# EAGLE schematic Brooder_sch_v1.1 (EAGLE 9.0.1)
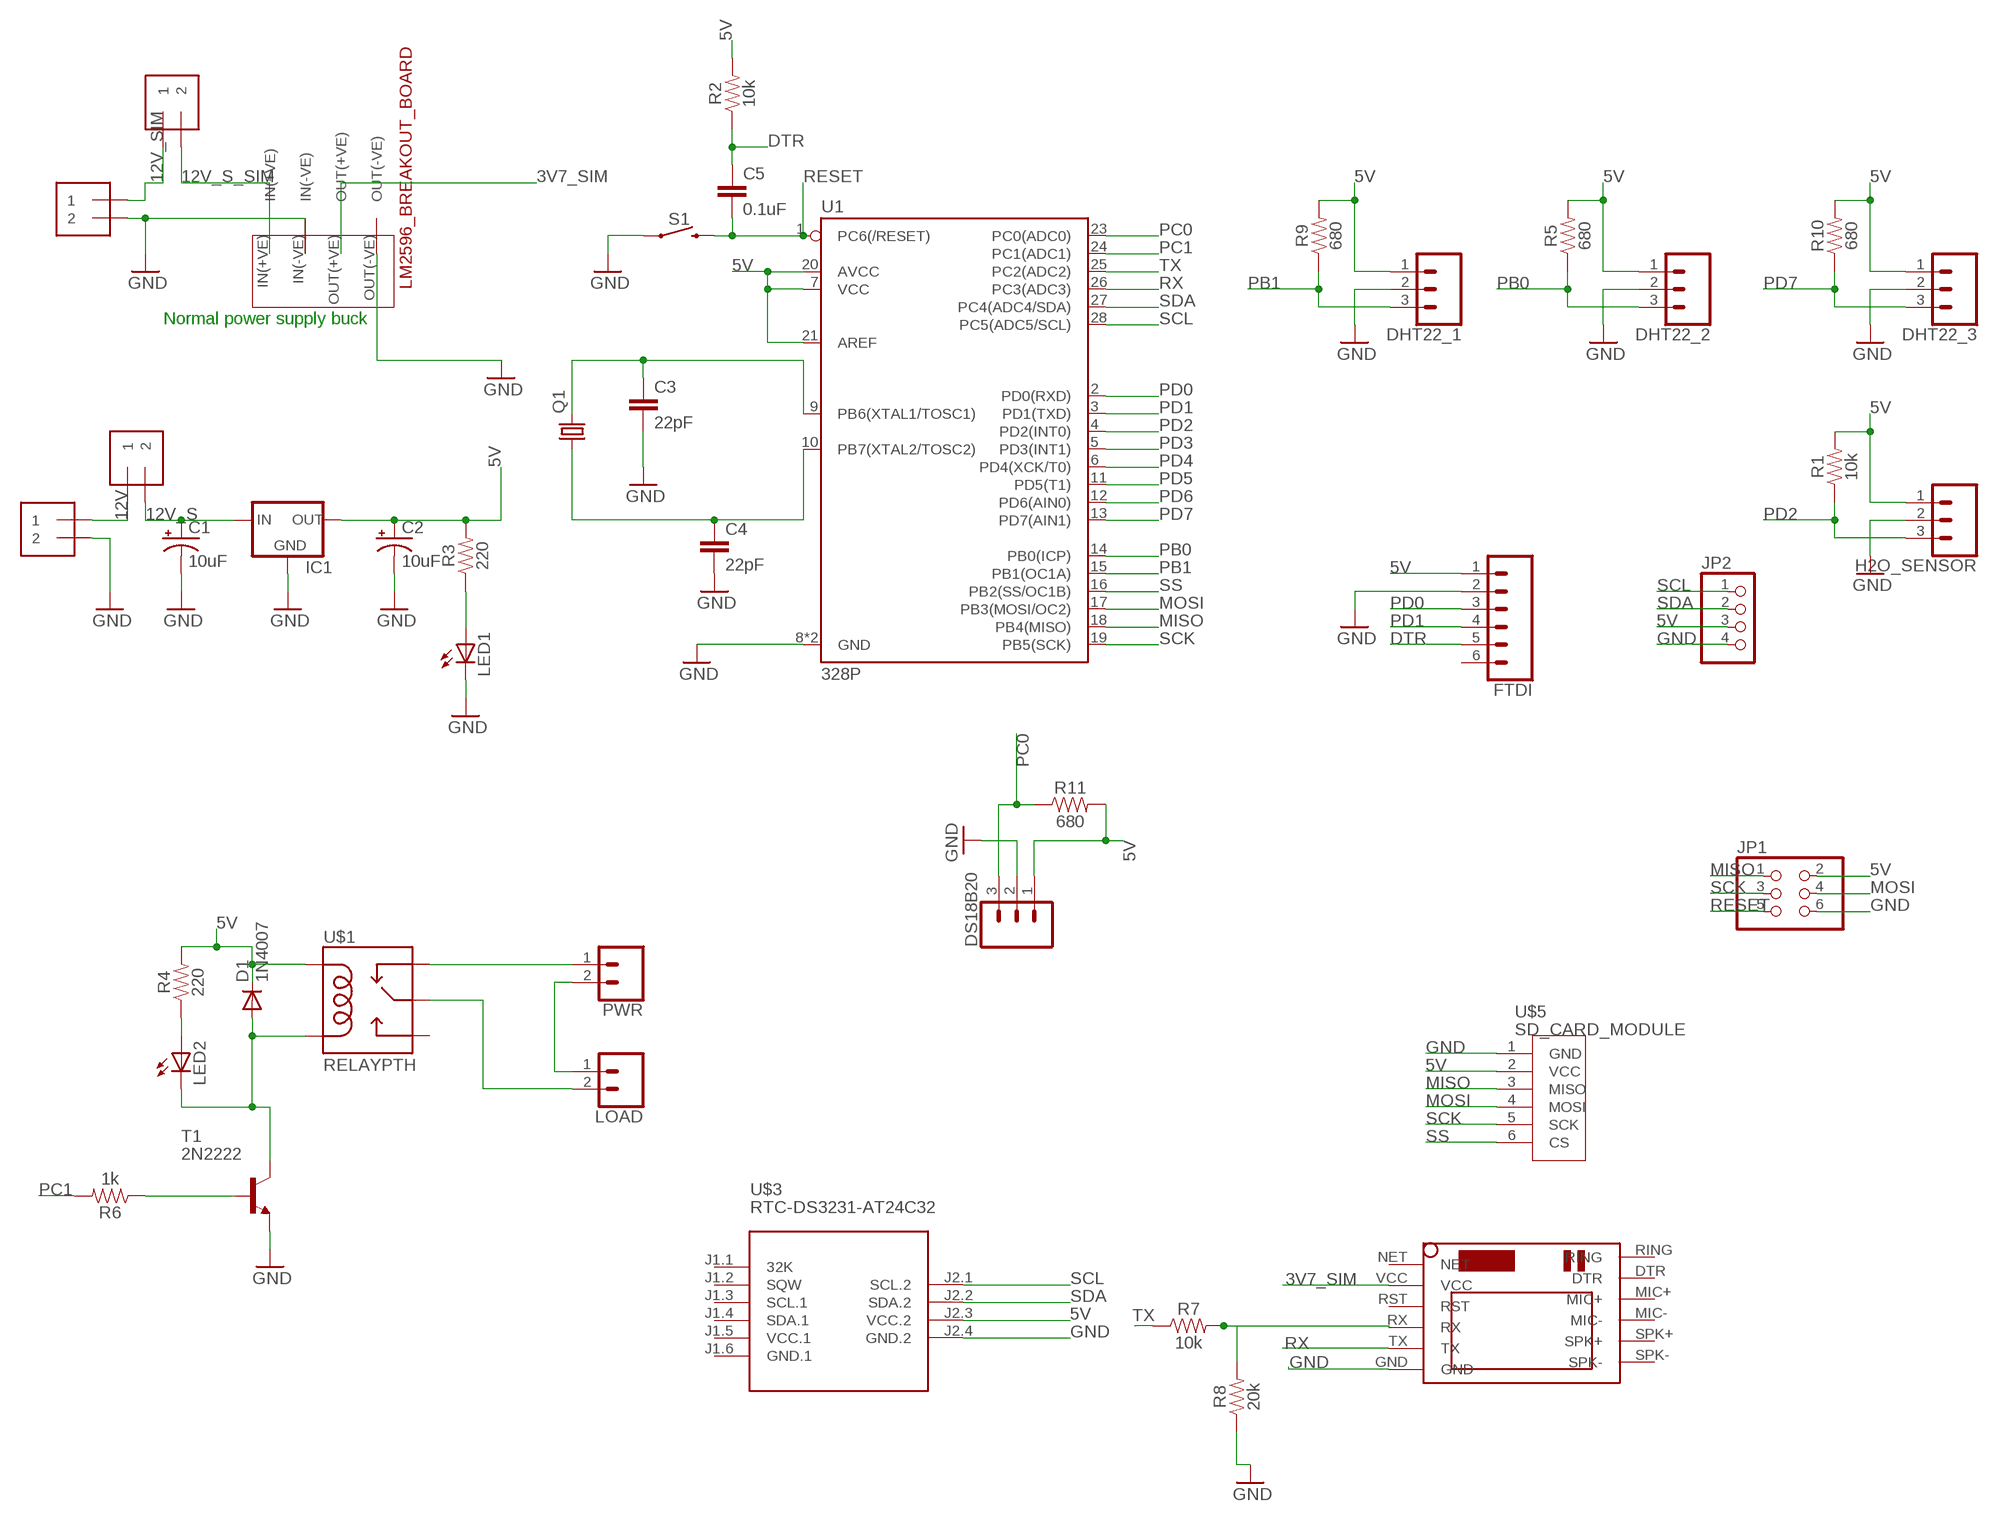
[diagram p0: schematic, sheet 1]

## Parts
12V_GSM  1X2-3.5MM  [1X2-3.5MM]
12V_SYS  1X2-3.5MM  [1X2-3.5MM]
C1  10uF  10UF-POLAR-RADIAL-2.5MM-25V-20%  [CPOL-RADIAL-2.5MM-5MM]
C2  10uF  10UF-POLAR-RADIAL-2.5MM-25V-20%  [CPOL-RADIAL-2.5MM-5MM]
C3  22pF  22PF-PTH-2.54MM-200V-5%  [CAP-PTH-2.54]
C4  22pF  22PF-PTH-2.54MM-200V-5%  [CAP-PTH-2.54]
C5  0.1uF  22PF-PTH-2.54MM-200V-5%  [CAP-PTH-2.54]
D1  1N4007  1N4004  [DO41-10]
DHT22_1  455-1750-1-ND  CONN_03  [1X03]
DHT22_2  455-1750-1-ND  CONN_03  [1X03]
DHT22_3  455-1750-1-ND  CONN_03  [1X03]
DS18B20  455-1750-1-ND  CONN_03  [1X03]
FTDI  CONN_06NO_SILK_FEMALE_PTH  [1X06_NO_SILK]
H2O_SENSOR  455-1750-1-ND  CONN_03  [1X03]
IC1  78XXS  [78XXS]
J2  1X2-3.5MM  [1X2-3.5MM]
J4  1X2-3.5MM  [1X2-3.5MM]
JP1  PINHD-2X3  [2X03]
JP2  PINHD-1X4  [1X04]
LED1  LED5MM  [LED5MM]
LED2  LED5MM  [LED5MM]
LOAD  CONN_025MM  [SCREWTERMINAL-5MM-2]
PWR  CONN_025MM  [SCREWTERMINAL-5MM-2]
Q1  CRYSTALHC49S  [HC49/S]
R1  10k  10MOHM-HORIZ-1/4W-5%  [AXIAL-0.3]
R2  10k  10MOHM-HORIZ-1/4W-5%  [AXIAL-0.3]
R3  220  10MOHM-HORIZ-1/4W-5%  [AXIAL-0.3]
R4  220  10MOHM-HORIZ-1/4W-5%  [AXIAL-0.3]
R5  680  10MOHM-HORIZ-1/4W-5%  [AXIAL-0.3]
R6  1k  10MOHM-HORIZ-1/4W-5%  [AXIAL-0.3]
R7  10k  10MOHM-HORIZ-1/4W-5%  [AXIAL-0.3]
R8  20k  10MOHM-HORIZ-1/4W-5%  [AXIAL-0.3]
R9  680  10MOHM-HORIZ-1/4W-5%  [AXIAL-0.3]
R10  680  10MOHM-HORIZ-1/4W-5%  [AXIAL-0.3]
R11  680  10MOHM-HORIZ-1/4W-5%  [AXIAL-0.3]
S1  SWITCH  MOMENTARY-SWITCH-SPST-PTH-6.0MM  [TACTILE_SWITCH_PTH_6.0MM]
T1  2N2222  [TO92-EBC-OVAL]
U1  328P  ATMEGA328P_PDIP  [DIP28]
U$1  RELAYPTH  [SRD-05VDC-SL-C]
U$2  LM2596_BREAKOUT_BOARDTHROUGH_HOLE  [LM2596_BREAKOUTBOARD]
U$3  RTC-DS3231-AT24C32  [RTC-DS3231-AT24C32]
U$5  SD_CARD_MODULE  [SD_CARD_MODULE]
U$6  SIM800LMODULE  [SIM800LMODULE]

## Nets
3V7_SIM: U$2.OUT(+VE) U$6.VCC
5V: C2.1(+) D1.C DHT22_1.1 DHT22_2.1 DHT22_3.1 DS18B20.1 FTDI.1 H2O_SENSOR.1 IC1.OUT JP1.2 JP2.3 R1.P$2 R2.P$2 R3.P$2 R4.P$2 R5.P$2 R9.P$2 R10.P$2 R11.P$2 U1.7(VCC) U1.20(AVCC) U1.21(AREF) U$1.COIL1 U$3.J2.3(VCC.2) U$5.2(VCC)
12V: 12V_SYS.1 J4.1
12V_S: C1.1(+) IC1.IN J4.2
12V_S_SIM: J2.2 U$2.IN(+VE)
12V_SIM: 12V_GSM.1 J2.1
DTR: C5.1 FTDI.5 R2.P$1
GND: 12V_GSM.2 12V_SYS.2 C1.2(-) C2.2(-) C3.2 C4.2 DHT22_1.2 DHT22_2.2 DHT22_3.2 DS18B20.2 FTDI.2 H2O_SENSOR.2 IC1.GND JP1.6 JP2.4 LED1.K(C) R8.P$1 S1.1 T1.E U1.8(GND) U1.22(GND) U$2.IN(-VE) U$2.OUT(-VE) U$3.J2.4(GND.2) U$5.1(GND) U$6.GND
MISO: JP1.1 U1.18(PB4(MISO)) U$5.3(MISO)
MOSI: JP1.4 U1.17(PB3(MOSI/OC2)) U$5.4(MOSI)
N$1: LOAD.2 U$1.SWCOMMON
N$2: LED1.A R3.P$1
N$3: LOAD.1 PWR.2
N$4: R7.P$2 R8.P$2 U$6.RX
N$5: C4.1 Q1.1 U1.10(PB7(XTAL2/TOSC2))
N$6: D1.A LED2.K(C) T1.C U$1.COIL0
N$7: LED2.A R4.P$1
N$8: C3.1 Q1.2 U1.9(PB6(XTAL1/TOSC1))
N$10: R6.P$1 T1.B
N$13: PWR.1 U$1.SWCLOSED(SWCLOSE)
PB0: DHT22_2.3 R5.P$1 U1.14(PB0(ICP))
PB1: DHT22_1.3 R9.P$1 U1.15(PB1(OC1A))
PC0: DS18B20.3 R11.P$1 U1.23(PC0(ADC0))
PC1: R6.P$2 U1.24(PC1(ADC1))
PD0: FTDI.3 U1.2(PD0(RXD))
PD1: FTDI.4 U1.3(PD1(TXD))
PD2: H2O_SENSOR.3 R1.P$1 U1.4(PD2(INT0))
PD3: U1.5(PD3(INT1))
PD4: U1.6(PD4(XCK/T0))
PD5: U1.11(PD5(T1))
PD6: U1.12(PD6(AIN0))
PD7: DHT22_3.3 R10.P$1 U1.13(PD7(AIN1))
RESET: C5.2 JP1.5 S1.3 U1.1(PC6(/RESET))
RX: U1.26(PC3(ADC3)) U$6.TX
SCK: JP1.3 U1.19(PB5(SCK)) U$5.5(SCK)
SCL: JP2.1 U1.28(PC5(ADC5/SCL)) U$3.J2.1(SCL.2)
SDA: JP2.2 U1.27(PC4(ADC4/SDA)) U$3.J2.2(SDA.2)
SS: U1.16(PB2(SS/OC1B)) U$5.6(CS)
TX: R7.P$1 U1.25(PC2(ADC2))
Unconnected: FTDI.6 U$1.SWOPEN U$3.J1.1(32K) U$3.J1.2(SQW) U$3.J1.3(SCL.1) U$3.J1.4(SDA.1) U$6.DTR U$6.MIC+ U$6.MIC- U$6.NET U$6.RING U$6.RST U$6.SPK+ U$6.SPK-

## Notes on the sheet
- Normal power supply buck

## Power pins joined to a net without a drawn wire
GND.1: U$3.J1.6(GND.1)
VCC.1: U$3.J1.5(VCC.1)

## Library data of the parts
12V_GSM 12V_SYS J2 J4 = adafruit:1X2: 3.5mm Terminal block http://www.ladyada.net/library/pcb/eaglelibrary.html
C1 C2 = SparkFun-Capacitors:10UF-POLAR: 10.0µF polarized capacitors A capacitor is a passive two-terminal electrical component used to store electrical energy temporarily in an electric field.; PROD_ID: CAP-08440
C3 C4 = SparkFun-Capacitors:22PF: 22pF ceramic capacitors A capacitor is a passive two-terminal electrical component used to store electrical energy temporarily in an electric field.; PROD_ID: CAP-09128
C5 = SparkFun-Capacitors:22PF: 22pF ceramic capacitors A capacitor is a passive two-terminal electrical component used to store electrical energy temporarily in an electric field.; PROD_ID: CAP-09128; VALUE: 22pF
D1 = adafruit:1N4004: DIODE General purpose 1N400x type rectifier (With bigger pads) http://www.ladyada.net/library/pcb/eaglelibrary.html
DHT22_1-DHT22_3 DS18B20 H2O_SENSOR = SparkFun-Connectors:CONN_03: Multi connection point. Often used as Generic Header-pin footprint for 0.1 inch spaced/style header connections On any of the 0.1 inch spaced packages, you can populate with these: Break Away Headers - Straight <https://www.sparkfun.com/products/116> (PRT-00116) Break Away Male Headers - Right Angle <https://www.sparkfun.com/products/553> (PRT-00553) Female Headers <https://www.sparkfun.com/products/115> (PRT-00115) Break Away Headers - Machine Pin <https://www.sparkfun.com/products/117> (PRT-00117) Break Away Female Headers - Swiss Machine Pin <https://www.sparkfun.com/products/743> (PRT-00743) Stackable Header - 3 Pin (Female, 0.1") <https://www.sparkfun.com/products/13875> (PRT-13875) For SCREWTERMINALS and SPRING TERMINALS visit here: Screw Terimnals on SparkFun.com <https://www.sparkfun.com/search/results?term=Screw+Terminals> (5mm/3.5mm/2.54mm spacing) This device is also useful as a general connection point to wire up your design to another part of your project. Our various solder wires solder well into these plated through hole pads. Hook-Up Wire - Assortment (Stranded, 22 AWG) <https://www.sparkfun.com/products/11375> (PRT-11375) Hook-Up Wire - Assortment (Solid Core, 22 AWG) <https://www.sparkfun.com/products/11367> (PRT-11367) View the entire wire category on our website here <https://www.sparkfun.com/categories/141> Special notes: Molex polarized connector foot print use with SKU : PRT-08232 with associated crimp pins and housings.; PROD_ID: XXX-00000
FTDI = SparkFun-Connectors:CONN_06: Multi connection point. Often used as Generic Header-pin footprint for 0.1 inch spaced/style header connections On any of the 0.1 inch spaced packages, you can populate with these: Break Away Headers - Straight <https://www.sparkfun.com/products/116> (PRT-00116) Break Away Male Headers - Right Angle <https://www.sparkfun.com/products/553> (PRT-00553) Female Headers <https://www.sparkfun.com/products/115> (PRT-00115) Break Away Headers - Machine Pin <https://www.sparkfun.com/products/117> (PRT-00117) Break Away Female Headers - Swiss Machine Pin <https://www.sparkfun.com/products/743> (PRT-00743) Arduino Stackable Header - 6 Pin <https://www.sparkfun.com/products/9280> (PRT-09280) For SCREWTERMINALS and SPRING TERMINALS visit here: Screw Terimnals on SparkFun.com <https://www.sparkfun.com/search/results?term=Screw+Terminals> (5mm/3.5mm/2.54mm spacing) This device is also useful as a general connection point to wire up your design to another part of your project. Our various solder wires solder well into these plated through hole pads. Hook-Up Wire - Assortment (Stranded, 22 AWG) <https://www.sparkfun.com/products/11375> (PRT-11375) Hook-Up Wire - Assortment (Solid Core, 22 AWG) <https://www.sparkfun.com/products/11367> (PRT-11367) View the entire wire category on our website here <https://www.sparkfun.com/categories/141>; PROD_ID: CONN-08437
IC1 = v-reg:78XXS: VOLTAGE REGULATOR
JP1 = pinhead:PINHD-2X3: PIN HEADER
JP2 = pinhead:PINHD-1X4: PIN HEADER
LED1 LED2 = adafruit:LED: LED OSRAM: - CHIPLED LG R971, LG N971, LY N971, LG Q971, LY Q971, LO R971, LY R971 LH N974, LH R974 LS Q976, LO Q976, LY Q976 LO Q996 - Hyper CHIPLED LW Q18S LB Q993, LB Q99A, LB R99A - SideLED LS A670, LO A670, LY A670, LG A670, LP A670 LB A673, LV A673, LT A673, LW A673 LH A674 LY A675 LS A676, LA A676, LO A676, LY A676, LW A676 LS A679, LY A679, LG A679 - Hyper Micro SIDELED® LS Y876, LA Y876, LO Y876, LY Y876 LT Y87S - SmartLED LW L88C, LW L88S LB L89C, LB L89S, LG L890 LS L89K, LO L89K, LY L89K LS L896, LA L896, LO L896, LY L896 - TOPLED LS T670, LO T670, LY T670, LG T670, LP T670 LSG T670, LSP T670, LSY T670, LOP T670, LYG T670 LG T671, LOG T671, LSG T671 LB T673, LV T673, LT T673, LW T673 LH T674 LS T676, LA T676, LO T676, LY T676, LB T676, LH T676, LSB T676, LW T676 LB T67C, LV T67C, LT T67C, LS T67K, LO T67K, LY T67K, LW E67C LS E67B, LA E67B, LO E67B, LY E67B, LB E67C, LV E67C, LT E67C LW T67C LS T679, LY T679, LG T679 LS T770, LO T770, LY T770, LG T770, LP T770 LB T773, LV T773, LT T773, LW T773 LH T774 LS E675, LA E675, LY E675, LS T675 LS T776, LA T776, LO T776, LY T776, LB T776 LHGB T686 LT T68C, LB T68C - Hyper Mini TOPLED® LB M676 - Mini TOPLED Santana® LG M470 LS M47K, LO M47K, LY M47K Source: http://www.osram.convergy.de/
LOAD PWR = SparkFun-Connectors:CONN_02: Multi connection point. Often used as Generic Header-pin footprint for 0.1 inch spaced/style header connections On any of the 0.1 inch spaced packages, you can populate with these: Break Away Headers - Straight <https://www.sparkfun.com/products/116> (PRT-00116) Break Away Male Headers - Right Angle <https://www.sparkfun.com/products/553> (PRT-00553) Female Headers <https://www.sparkfun.com/products/115> (PRT-00115) Break Away Headers - Machine Pin <https://www.sparkfun.com/products/117> (PRT-00117) Break Away Female Headers - Swiss Machine Pin <https://www.sparkfun.com/products/743> (PRT-00743) For SCREWTERMINALS and SPRING TERMINALS visit here: Screw Terimnals on SparkFun.com <https://www.sparkfun.com/search/results?term=Screw+Terminals> (5mm/3.5mm/2.54mm spacing) This device is also useful as a general connection point to wire up your design to another part of your project. Our various solder wires solder well into these plated through hole pads. Hook-Up Wire - Assortment (Stranded, 22 AWG) <https://www.sparkfun.com/products/11375> (PRT-11375) Hook-Up Wire - Assortment (Solid Core, 22 AWG) <https://www.sparkfun.com/products/11367> (PRT-11367) View the entire wire category on our website here <https://www.sparkfun.com/categories/141> Special notes: Molex polarized connector foot print use with: PRT-08233 with associated crimp pins and housings. 2.54_SCREWTERM for use with PRT-10571. 3.5mm Screw Terminal footprints for PRT-08084 5mm Screw Terminal footprints for use with PRT-08432; SF_SKU: PRT-08432
Q1 = adafruit:CRYSTAL: CRYSTAL; OC_FARNELL: 1667008; OC_NEWARK: unknown
R1-R11 = SparkFun-Resistors:10MOHM: RES-09327; PROD_ID: RES-09327; VALUE: 10M
S1 = SparkFun-Switches:MOMENTARY-SWITCH-SPST: Momentary Switch (Pushbutton) - SPST Normally-open (NO) SPST momentary switches (buttons, pushbuttons). Variants PTH-12MM - 12mm square, through-hole Momentary Pushbutton Switch - 12mm Square <https://www.sparkfun.com/products/9190> (COM-09190) PTH-6.0MM, PTH-6.0MM-KIT - 6.0mm square, through-hole Mini Pushbutton Switch <https://www.sparkfun.com/products/97> (COM-00097) KIT package intended for soldering kit's - only one side of pads' copper is exposed. PTH-RIGHT-ANGLE-KIT - Right-angle, through-hole Right Angle Tactile Button <https://www.sparkfun.com/products/10791> - Used on SparkFun BigTime Watch Kit <https://www.sparkfun.com/products/11734> SMD-12MM - 12mm square, surface-mount Tactile Button - SMD (12mm) <https://www.sparkfun.com/products/12993> (COM-12993) Used on SparkFun PicoBoard <https://www.sparkfun.com/products/11888> SMD-4.5MM - 4.5mm Square Trackball Switch Used on SparkFun Blackberry Trackballer Breakout <https://www.sparkfun.com/products/13169> SMD-4.6MMX2.8MM - 4.60mm x 2.80mm, surface mount Used on SparkFun SAMD21 Mini Breakout <https://www.sparkfun.com/products/13664> SMD-5.2MM, SMD-5.2-REDUNDANT - 5.2mm square, surface-mount Mini Pushbutton Switch - SMD <https://www.sparkfun.com/products/8720> (COM-08720) Used on Arduino Pro Mini <https://www.sparkfun.com/products/11114> REDUNDANT package connects both switch circuits together SMD-6.0X3.5MM - 6.0 x 3.5mm, surface mount Momentary Reset Switch SMD <https://www.sparkfun.com/products/8229> (COM-08229) SMD-6.2MM-TALL - 6.2mm square, surface mount Tactile Button - SMD (6mm) <https://www.sparkfun.com/products/12992> Used on SparkFun Digital Sandbox <https://www.sparkfun.com/products/12651> SMD-RIGHT-ANGLE - Right-angle, surface mount Used on SparkFun Block for Intel® Edison - Arduino <https://www.sparkfun.com/products/13036>; PROD_ID: SWCH-08441; SF_SKU: COM-00097
T1 = adafruit:2N2222: NPN TRANSISTOR Big oval pads
U1 = SparkFun-IC-Microcontroller:ATMEGA328P_PDIP: Atmel 328P Through hole ATMEGA328P uC used in the Arduino 32kb flash, 1k EEPROM, 2k SRAM Datasheet <http://www.sparkfun.com/datasheets/Components/SMD/ATMega328.pdf> SparkFun Products Storefront component: AVR 28 Pin 20MHz 32K 6A/D - ATMega328P <https://www.sparkfun.com/products/9061> (COM-09061) SparkFun Simon Says - Through-Hole Soldering Kit <https://www.sparkfun.com/products/10547> (KIT-10547) SparkFun Learn to Solder - Simon Says <https://www.sparkfun.com/products/13708> (KIT-13708) SparkFun BigTime Watch Kit <https://www.sparkfun.com/products/11734> (KIT-11734) SparkFun ClockIt <https://www.sparkfun.com/products/10930> (KIT-10930) SparkFun Serial Enabled LCD Kit <https://www.sparkfun.com/products/10097> (LCD-10097) SparkFun Simon Tilts - Through Hole Soldering Kit <https://www.sparkfun.com/products/12634> (KIT-12634) SparkFun Frequency Counter Kit <https://www.sparkfun.com/products/10140> (KIT-10140) FabFM Radio Kit <https://www.sparkfun.com/products/11043> (KIT-11043) SparkFun Binary Blaster Kit <https://www.sparkfun.com/products/12037> (KIT-12037) SparkFun Metro-Gnome <https://www.sparkfun.com/products/9236> (KIT-09236) ATmega328 with Arduino Optiboot (Uno) <https://www.sparkfun.com/products/10524> (DEV-10524); PROD_ID: IC-09136
U$1 = SRD-05VDC-SL-C:RELAY: SPDT relay (COM-00101)
U$2 = LM2596_BREAKOUT_BOARD:LM2596_BREAKOUT_BOARD
U$3 = diy-modules-1.8.0:RTC-DS3231-AT24C32: RTC Module with Battery and EEPROM based on DS3231 and AT24C32 chips Tutorial can be found here: https://edwardmallon.wordpress.com/2014/05/21/using-a-cheap-3-ds3231-rtc-at24c32-eeprom-from-ebay/ Click here to find device on ebay.com <http://www.ebay.com/sch/DS3231+AT24C32+module>
U$5 = custom_libraries:SD_CARD_MODULE
U$6 = SIM800LMODULE:SIM800LMODULE: SIM800L Module